# Altium project QSTL_24DC_4MW_PCB.PrjPcb
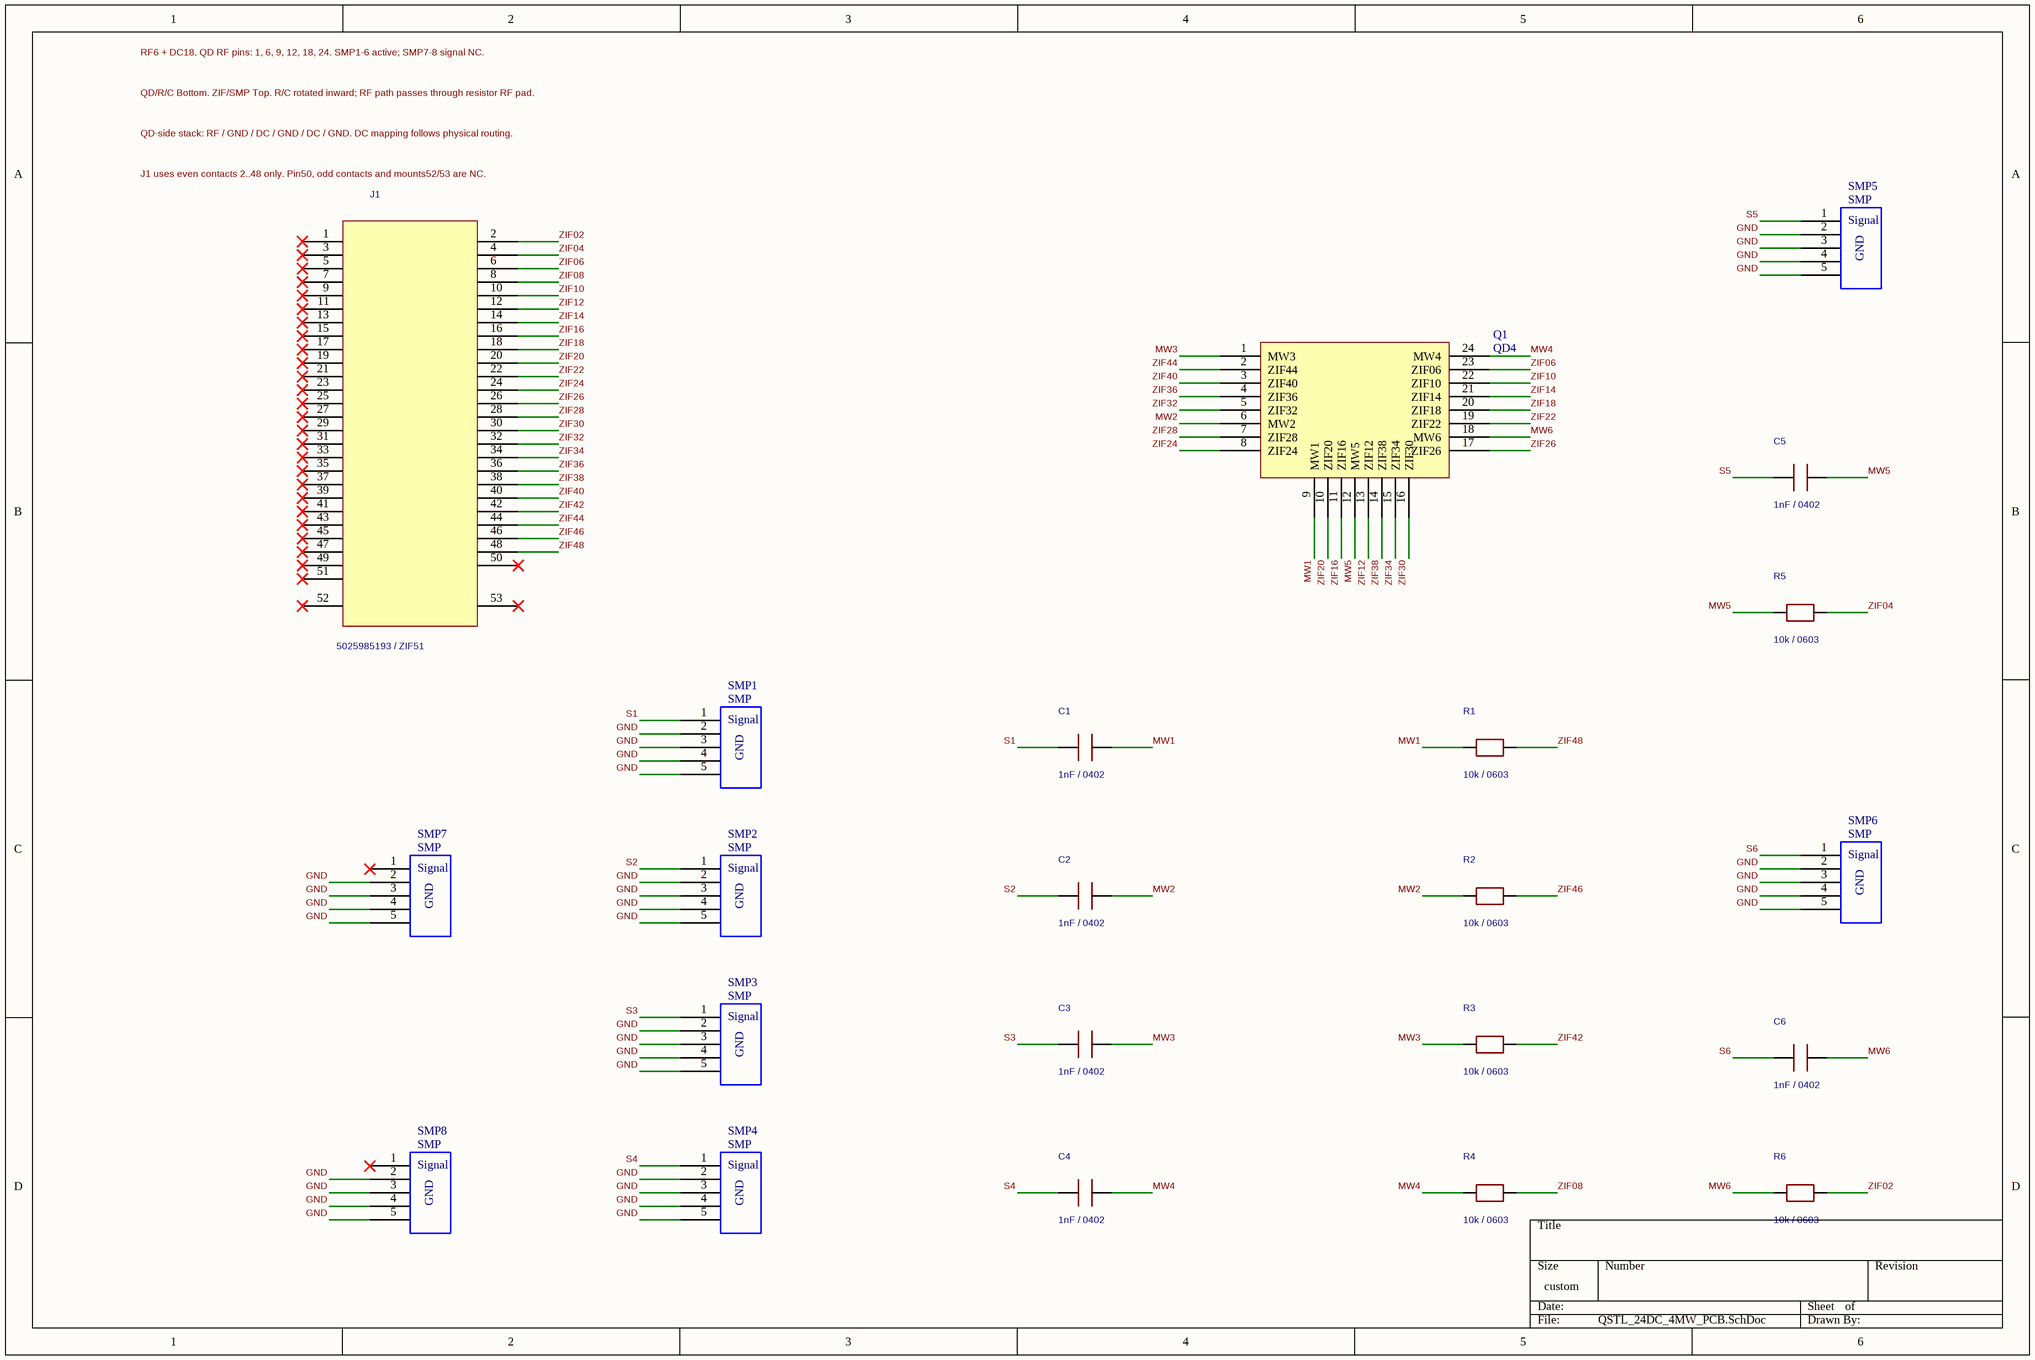
[diagram p0: QSTL_24DC_4MW_PCB.SchDoc]
1 sheet, 22 parts. Net scope: global (net labels, ports and power ports of the same name join across sheets).
Board file: QSTL_24DC_4MW_PCB.PcbDoc

## Sheet QSTL_24DC_4MW_PCB.SchDoc: QSTL carrier - RF6 + DC18; QD/R/C Bottom
size 381 x 254 mm; SheetNumber: 1; SheetTotal: 1

### Parts
C1  1nF / 0402  [FP-GCM155-0_05-IPC_A]
C2  1nF / 0402  [FP-GCM155-0_05-IPC_A]
C3  1nF / 0402  [FP-GCM155-0_05-IPC_A]
C4  1nF / 0402  [FP-GCM155-0_05-IPC_A]
C5  1nF / 0402  [FP-GCM155-0_05-IPC_A]
C6  1nF / 0402  [FP-GCM155-0_05-IPC_A]
J1  5025985193 / ZIF51  [FP-5025985193-MFG]
Q1  QD4  [QD4]
R1  10k / 0603  [CC1608-0603]
R2  10k / 0603  [CC1608-0603]
R3  10k / 0603  [CC1608-0603]
R4  10k / 0603  [CC1608-0603]
R5  10k / 0603  [CC1608-0603]
R6  10k / 0603  [CC1608-0603]
SMP1  SMP  [RF_Con]
SMP2  SMP  [RF_Con]
SMP3  SMP  [RF_Con]
SMP4  SMP  [RF_Con]
SMP5  SMP  [RF_Con]
SMP6  SMP  [RF_Con]
SMP7  SMP  [RF_Con]
SMP8  SMP  [RF_Con]

### Nets
GND: SMP1.2 SMP1.3 SMP1.4 SMP1.5 SMP2.2 SMP2.3 SMP2.4 SMP2.5 SMP3.2 SMP3.3 SMP3.4 SMP3.5 SMP4.2 SMP4.3 SMP4.4 SMP4.5 SMP5.2 SMP5.3 SMP5.4 SMP5.5 SMP6.2 SMP6.3 SMP6.4 SMP6.5 SMP7.2 SMP7.3 SMP7.4 SMP7.5 SMP8.2 SMP8.3 SMP8.4 SMP8.5
MW1: C1.2 Q1.9(MW1) R1.1
MW2: C2.2 Q1.6(MW2) R2.1
MW3: C3.2 Q1.1(MW3) R3.1
MW4: C4.2 Q1.24(MW4) R4.1
MW5: C5.2 Q1.12(MW5) R5.1
MW6: C6.2 Q1.18(MW6) R6.1
S1: C1.1 SMP1.1
S2: C2.1 SMP2.1
S3: C3.1 SMP3.1
S4: C4.1 SMP4.1
S5: C5.1 SMP5.1
S6: C6.1 SMP6.1
ZIF02: J1.2 R6.2
ZIF04: J1.4 R5.2
ZIF06: J1.6 Q1.23(ZIF06)
ZIF08: J1.8 R4.2
ZIF10: J1.10 Q1.22(ZIF10)
ZIF12: J1.12 Q1.13(ZIF12)
ZIF14: J1.14 Q1.21(ZIF14)
ZIF16: J1.16 Q1.11(ZIF16)
ZIF18: J1.18 Q1.20(ZIF18)
ZIF20: J1.20 Q1.10(ZIF20)
ZIF22: J1.22 Q1.19(ZIF22)
ZIF24: J1.24 Q1.8(ZIF24)
ZIF26: J1.26 Q1.17(ZIF26)
ZIF28: J1.28 Q1.7(ZIF28)
ZIF30: J1.30 Q1.16(ZIF30)
ZIF32: J1.32 Q1.5(ZIF32)
ZIF34: J1.34 Q1.15(ZIF34)
ZIF36: J1.36 Q1.4(ZIF36)
ZIF38: J1.38 Q1.14(ZIF38)
ZIF40: J1.40 Q1.3(ZIF40)
ZIF42: J1.42 R3.2
ZIF44: J1.44 Q1.2(ZIF44)
ZIF46: J1.46 R2.2
ZIF48: J1.48 R1.2

Not connected (* = marked no-connect by the designer): J1 1* 3* 5* 7* 9* 11* 13* 15* 17* 19* 21* 23* 25* 27* 29* 31* 33* 35* 37* 39* 41* 43* 45* 47* 49* 50* 51* 52(MNT_1)* 53(MNT_2)*; SMP7 1*; SMP8 1*

### Notes on the sheet
- RF6 + DC18. QD RF pins: 1, 6, 9, 12, 18, 24. SMP1-6 active; SMP7-8 signal NC.
- QD/R/C Bottom. ZIF/SMP Top. R/C rotated inward; RF path passes through resistor RF pad.
- QD-side stack: RF / GND / DC / GND / DC / GND. DC mapping follows physical routing.
- J1 uses even contacts 2..48 only. Pin50, odd contacts and mounts52/53 are NC.
- (in symbol SMP) Signal; GND

### Library data of the parts
C1-C4 = C_0603_1nF: Ceramic capacitor 1nF 0402; GCM1555C1H102FA16D; Layout status: RF6/DC18; QD/R/C Bottom; inline RF resistor pad; via in pad; Value: 1nF; Case/Package: 0402
C5 C6 = C_0603_1nF: Symmetric placement-only addition; signal pins intentionally unassigned; Layout status: RF6/DC18; QD/R/C Bottom; inline RF resistor pad; via in pad; Value: 1nF; Case/Package: 0402
J1 = ZIF_5025985193_53: Molex5025985193;51signals+2mountpads; single-part local symbol derived from actual native two-part source; Manufacturer: Molex; Manufacturer Part Number: 5025985193
Q1 = QD4: QD24; RF pins1,6,9,12,18,24; DC18
R1-R4 = R_0603_10k: Generic 0603 resistor 10k; value from saved reference schematic; Layout status: RF6/DC18; QD/R/C Bottom; inline RF resistor pad; via in pad; Value: 10k; Case/Package: 0603 (1608 metric)
R5 R6 = R_0603_10k: Symmetric placement-only addition; signal pins intentionally unassigned; Layout status: RF6/DC18; QD/R/C Bottom; inline RF resistor pad; via in pad; Value: 10k; Case/Package: 0603 (1608 metric)
SMP5 SMP6 = SMP: Symmetric placement-only addition; signal pins intentionally unassigned
SMP7 SMP8 = SMP: Restored reference SMP; signal pin1 intentionally NC; shield pins2-5 GND